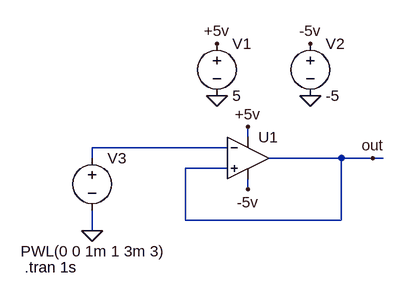
[diagram p0: schematic Draft1.asc]
Draft1.asc, the LTspice schematic file:
Version 4
SHEET 1 880 680
WIRE 272 160 272 144
WIRE 240 176 32 176
WIRE 32 192 32 176
WIRE 416 192 304 192
WIRE 464 192 416 192
WIRE 480 192 464 192
WIRE 240 208 176 208
WIRE 272 240 272 224
WIRE 176 288 176 208
WIRE 416 288 416 192
WIRE 416 288 176 288
WIRE 32 304 32 272
FLAG 224 96 0
FLAG 368 96 0
FLAG 224 16 +5v
FLAG 368 16 -5v
FLAG 272 240 -5v
FLAG 272 144 +5v
FLAG 32 304 0
FLAG 464 192 out
SYMBOL voltage 224 0 R0
WINDOW 123 0 0 Left 0
WINDOW 39 0 0 Left 0
SYMATTR InstName V1
SYMATTR Value 5
SYMBOL voltage 368 0 R0
WINDOW 123 0 0 Left 0
WINDOW 39 0 0 Left 0
SYMATTR InstName V2
SYMATTR Value -5
SYMBOL voltage 32 176 R0
WINDOW 3 -110 159 Left 2
WINDOW 123 0 0 Left 0
WINDOW 39 0 0 Left 0
SYMATTR InstName V3
SYMATTR Value PWL(0 0 1m 1 3m 3)
SYMBOL OpAmps\\UniversalOpAmp1 272 192 R0
SYMATTR InstName U1
TEXT -72 360 Left 2 !.tran 1s

The netlist it stands for:
* Draft1.asc
V1 +5v 0 5
V2 -5v 0 -5
V3 N001 0 PWL(0 0 1m 1 3m 3)
XU1 out N001 +5v -5v out level1 Avol=1Meg GBW=10Meg Vos=0 En=0 Enk=0 In=0 Ink=0 Rin=500Meg  ; pins In+ In- V+ V- OUT
.tran 1s
.lib UniversalOpAmp1.lib
.backanno
.end